# EAGLE design pcf8574-breakout (EAGLE 7.1.0)
CNAME: PCF8574 Breakout Board; CREVISION: 0.1; DESIGNER: RNDC
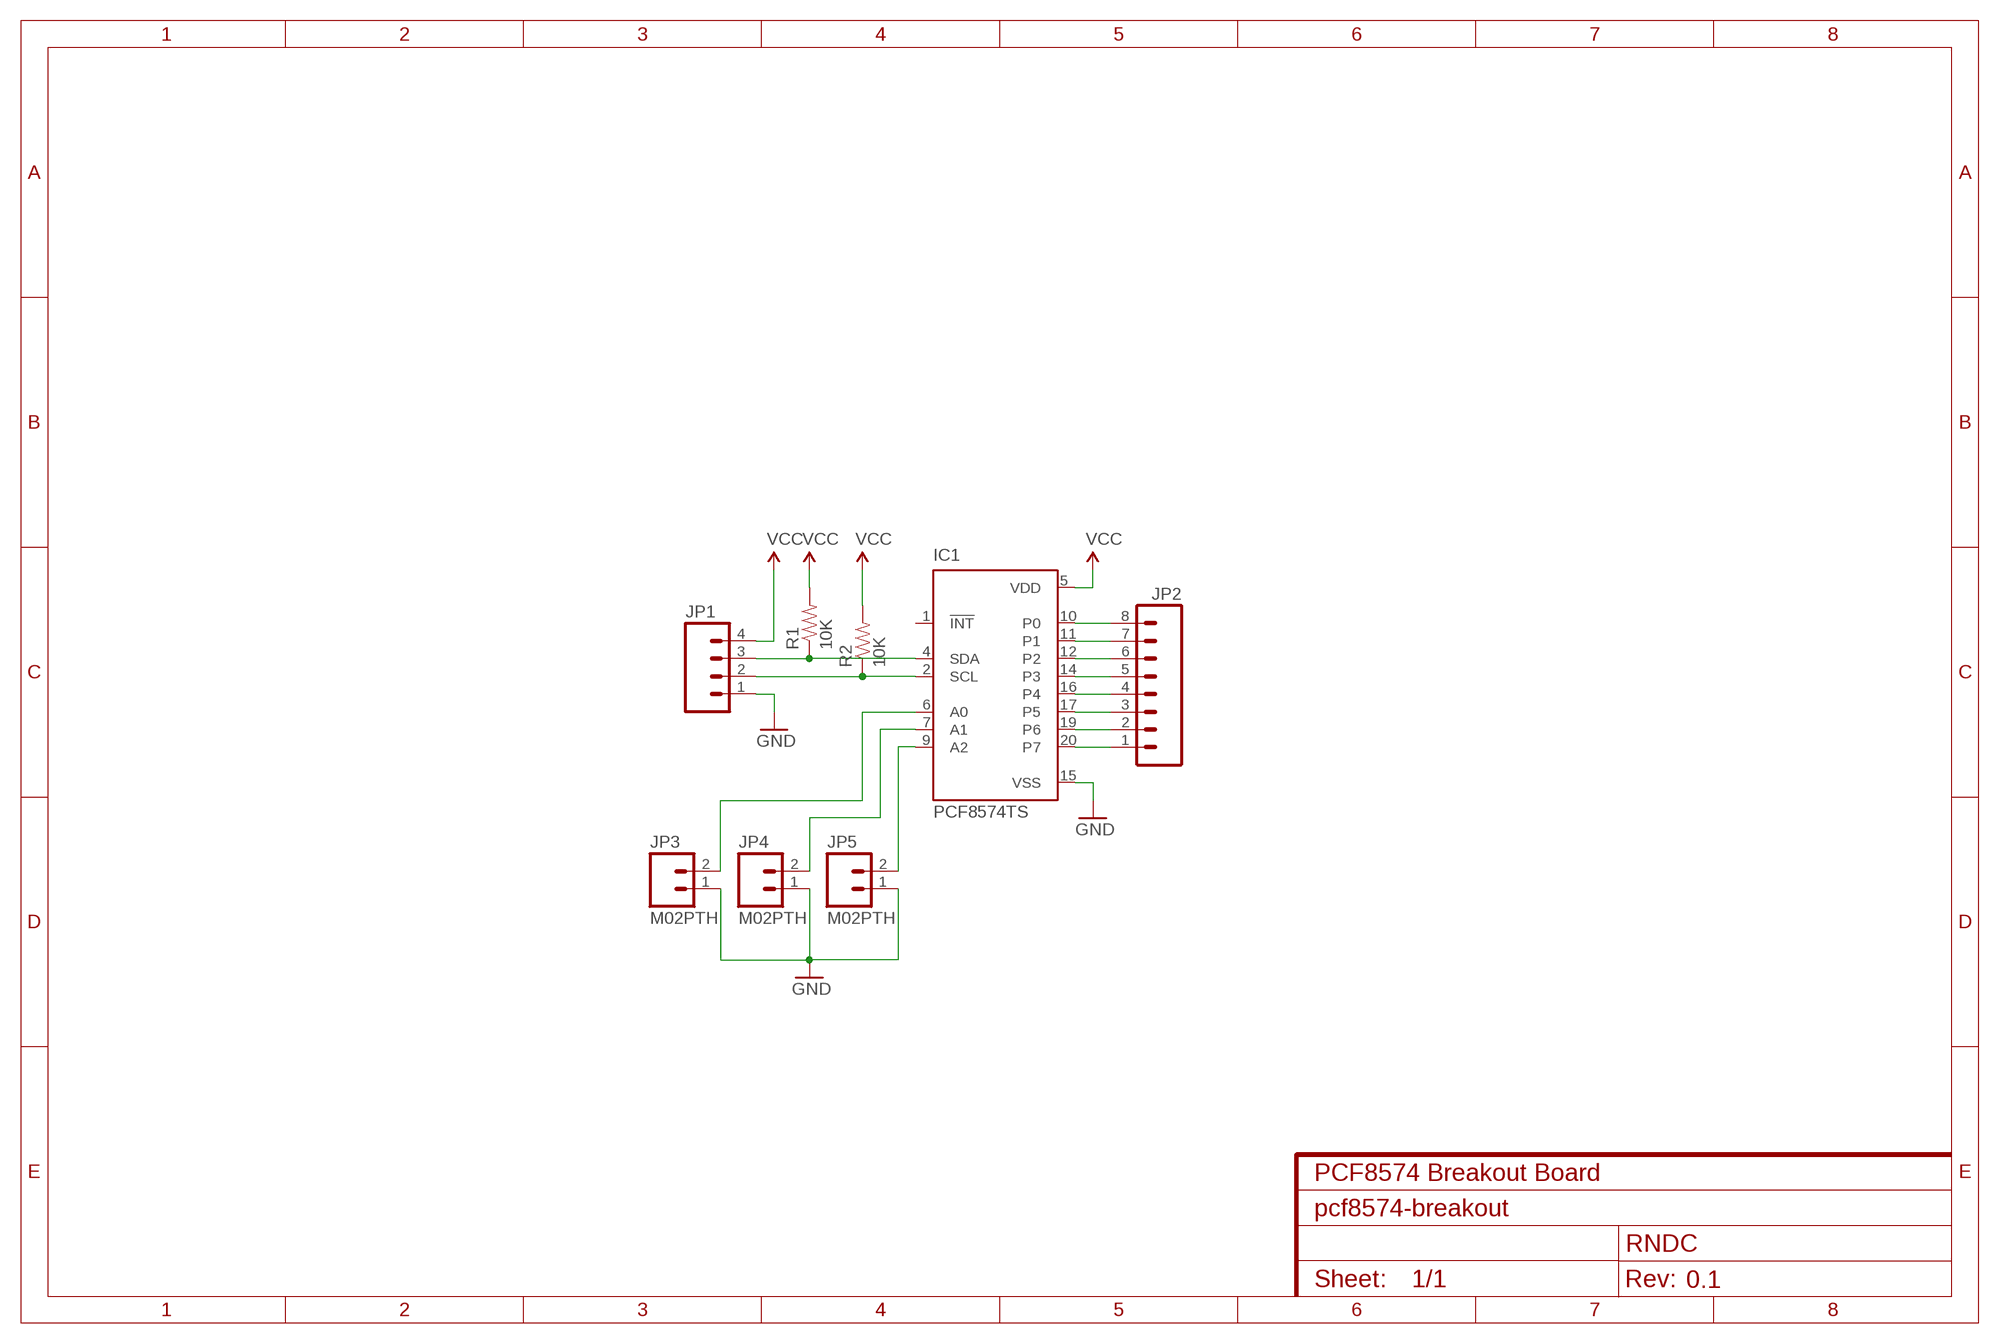
[diagram p0: schematic, sheet 1]

## Parts
IC1  PCF8574TS  [SSOP20]
JP1  M04PTH  [1X04]
JP2  M081X08  [1X08]
JP3  M02PTH  [1X02]
JP4  M02PTH  [1X02]
JP5  M02PTH  [1X02]
R1  10K  RESISTOR0603-RES  [0603-RES]
R2  10K  RESISTOR0603-RES  [0603-RES]

## Nets
GND: IC1.15(VSS) JP1.1 JP3.1 JP4.1 JP5.1
N$1: IC1.2(SCL) JP1.2 R2.1
N$2: IC1.4(SDA) JP1.3 R1.1
N$3: IC1.20(P7) JP2.1
N$4: IC1.19(P6) JP2.2
N$5: IC1.17(P5) JP2.3
N$6: IC1.16(P4) JP2.4
N$7: IC1.14(P3) JP2.5
N$8: IC1.12(P2) JP2.6
N$9: IC1.11(P1) JP2.7
N$10: IC1.10(P0) JP2.8
N$11: IC1.9(A2) JP5.2
N$12: IC1.7(A1) JP4.2
N$13: IC1.6(A0) JP3.2
VCC: IC1.5(VDD) JP1.4 R1.2 R2.2
Unconnected: IC1.1(!INT)

## Library data of the parts
IC1 = micro-philips:PCF8574: I2C-Bus Remote 8-bit I/O expander http://www.semiconductors.philips.com/acrobat_download/datasheets/PCF8574_4.pdf; MPN: PCF8574TS/3,118; OC_FARNELL: 1506644; OC_NEWARK: 70R6873
JP1 = SparkFun-Connectors:M04: Header 4 Standard 4-pin 0.1" header. Use with straight break away headers (SKU : PRT-00116), right angle break away headers (PRT-00553), swiss pins (PRT-00743), machine pins (PRT-00117), and female headers (PRT-00115). Molex polarized connector foot print use with SKU : PRT-08231 with associated crimp pins and housings. 1MM SMD Version SKU: PRT-10208
JP2 = SparkFun-Connectors:M08: Header 8 Standard 8-pin 0.1" header. Use with straight break away headers (SKU : PRT-00116), right angle break away headers (PRT-00553), swiss pins (PRT-00743), machine pins (PRT-00117), and female headers (PRT-00115).
JP3-JP5 = SparkFun-Connectors:M02: Standard 2-pin 0.1" header. Use with - straight break away headers ( PRT-00116) - right angle break away headers (PRT-00553) - swiss pins (PRT-00743) - machine pins (PRT-00117) - female headers (PRT-00115) Molex polarized connector foot print use with: PRT-08233 with associated crimp pins and housings. 2.54_SCREWTERM for use with PRT-10571. 3.5mm Screw Terminal footprints for PRT-08084 5mm Screw Terminal footprints for use with PRT-08432
R1 R2 = SparkFun-Passives:RESISTOR: Resistor Basic schematic elements and footprints for 0603, 1206, and PTH resistors.

## Board
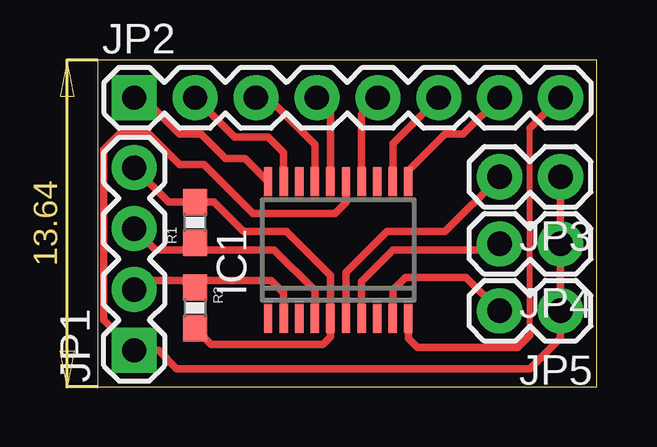
[diagram p1: board, top side]

Size 20.81 x 13.64 mm. Coordinates in mm from the lower left corner, seen from the top.
Outline: 0,0 20.81,0 20.81,13.64 0,13.64 0,0
Copper layers (1*16): Top 0.035mm / dielectric 1.5mm / Bottom 0.035mm
Design rules "default": minimum track width 10mil, minimum drill 24mil, track to track 8mil, track to pad 8mil, pad to pad 8mil, via to via 8mil, smd to smd 8mil, copper to edge 40mil, drill to drill 8mil, minimum pad ring 10mil, minimum via ring 8mil, stop-mask expansion 4mil, vias tented up to drill 0mil, thermal gap 10mil

### Footprints (pad centres in the part's own frame; a part is rotated, then mirrored left to right if it is on the bottom)
SSOP20 = smd 0.35 x 1.2: 1 -2.925,-2.85; 2 -2.275,-2.85; 3 -1.625,-2.85; 4 -0.975,-2.85; 5 -0.325,-2.85; 6 0.325,-2.85; 7 0.975,-2.85; 8 1.625,-2.85; 9 2.275,-2.85; 10 2.925,-2.85; 11 2.925,2.85; 12 2.275,2.85; 13 1.625,2.85; 14 0.975,2.85; 15 0.325,2.85; 16 -0.325,2.85; 17 -0.975,2.85; 18 -1.625,2.85; 19 -2.275,2.85; 20 -2.925,2.85
1X04 = drill 1.016 pad 1.88 square: 1 0,0 | drill 1.016 pad 1.88: 2 2.54,0; 3 5.08,0; 4 7.62,0
1X08 = drill 1.016 pad 1.88 square: 1 0,0 | drill 1.016 pad 1.88: 2 2.54,0; 3 5.08,0; 4 7.62,0; 5 10.16,0; 6 12.7,0; 7 15.24,0; 8 17.78,0
1X02 = drill 1.016 pad 1.88: 1 0,0; 2 2.54,0
0603-RES = smd 1.1 x 1: 1 -0.85,0; 2 0.85,0

### Placement (x,y rotation side)
IC1  10.03,5.71 0 top
JP1  1.52,1.52 90 top
JP2  1.52,12.06 0 top
JP3  19.3,8.76 180 top
JP4  19.3,5.97 180 top
JP5  19.3,3.17 180 top
R1  4.06,6.86 90 top
R2  4.06,3.3 270 top

### Tracks (layer width: path | path; a pad name or v marks a point on that pad's centre or on a via)
GND
  Top 0.305: JP3.1 JP4.1 JP5.1 19.3,2.03 18.03,0.76 3.3,0.76 2.54,1.52 JP1.1 0.25,2.79 0.25,9.91 1.02,10.67 2.03,10.67 3.43,9.27 4.45,9.27 6.48,7.24 9.91,7.24 10.36,7.69 IC1.15
N$1
  Top 0.305: JP1.2 1.91,4.45 3.56,4.45 3.85,4.15 R2.1 4.36,4.45 7.24,4.45 7.76,3.93 IC1.2
N$2
  Top 0.305: JP1.3 2.41,5.71 3.56,5.71 3.85,6.01 R1.1 4.36,5.71 7.37,5.71 9.06,4.02 IC1.4
N$3
  Top 0.305: IC1.20 6.15,9.53 5.33,9.53 4.32,10.54 3.43,10.54 1.91,12.06 JP2.1
N$4
  Top 0.305: IC1.19 7.76,9.77 7.11,10.41 5.71,10.41 JP2.2
N$5
  Top 0.305: IC1.17 9.06,10.12 7.37,11.81 6.86,11.81 JP2.3
N$6
  Top 0.305: IC1.16 9.71,11.5 JP2.4
N$7
  Top 0.305: IC1.14 11.01,11.39 JP2.5
N$8
  Top 0.305: IC1.12 12.31,10.15 JP2.6
N$9
  Top 0.305: IC1.11 12.96,9.02 14.48,10.54 15.24,10.54 JP2.7
N$10
  Top 0.254: 18.03,2.16 18.03,10.79
  Top 0.305: IC1.10 12.96,2.03 13.34,1.65 17.53,1.65 18.03,2.16 | 18.03,10.79 JP2.8
N$11
  Top 0.305: IC1.9 12.31,4.05 12.83,4.57 15.37,4.57 JP5.2
N$12
  Top 0.305: IC1.7 11.01,4.4 12.32,5.71 16.51,5.71 JP4.2
N$13
  Top 0.305: IC1.6 10.36,4.77 12.06,6.48 14.48,6.48 JP3.2
VCC
  Top 0.305: JP1.4 2.96,7.71 R1.2 4.87,7.71 6.1,6.48 7.87,6.48 9.71,4.64 IC1.5 9.71,2.09 9.4,1.78 4.74,1.78 R2.2